# EasyEDA Pro project Balance_Car.eprj

# Schematic STM32平衡车原理图_1
Create Date: 2024-09-20; Page Name: P1; Project Name: ProDocument_P1_2024-05-12; Schematic Name: STM32平衡车原理图_1; Update Date: 2024-11-16; Company: 嘉立创EDA; Page Size: A4; Version: V1.0
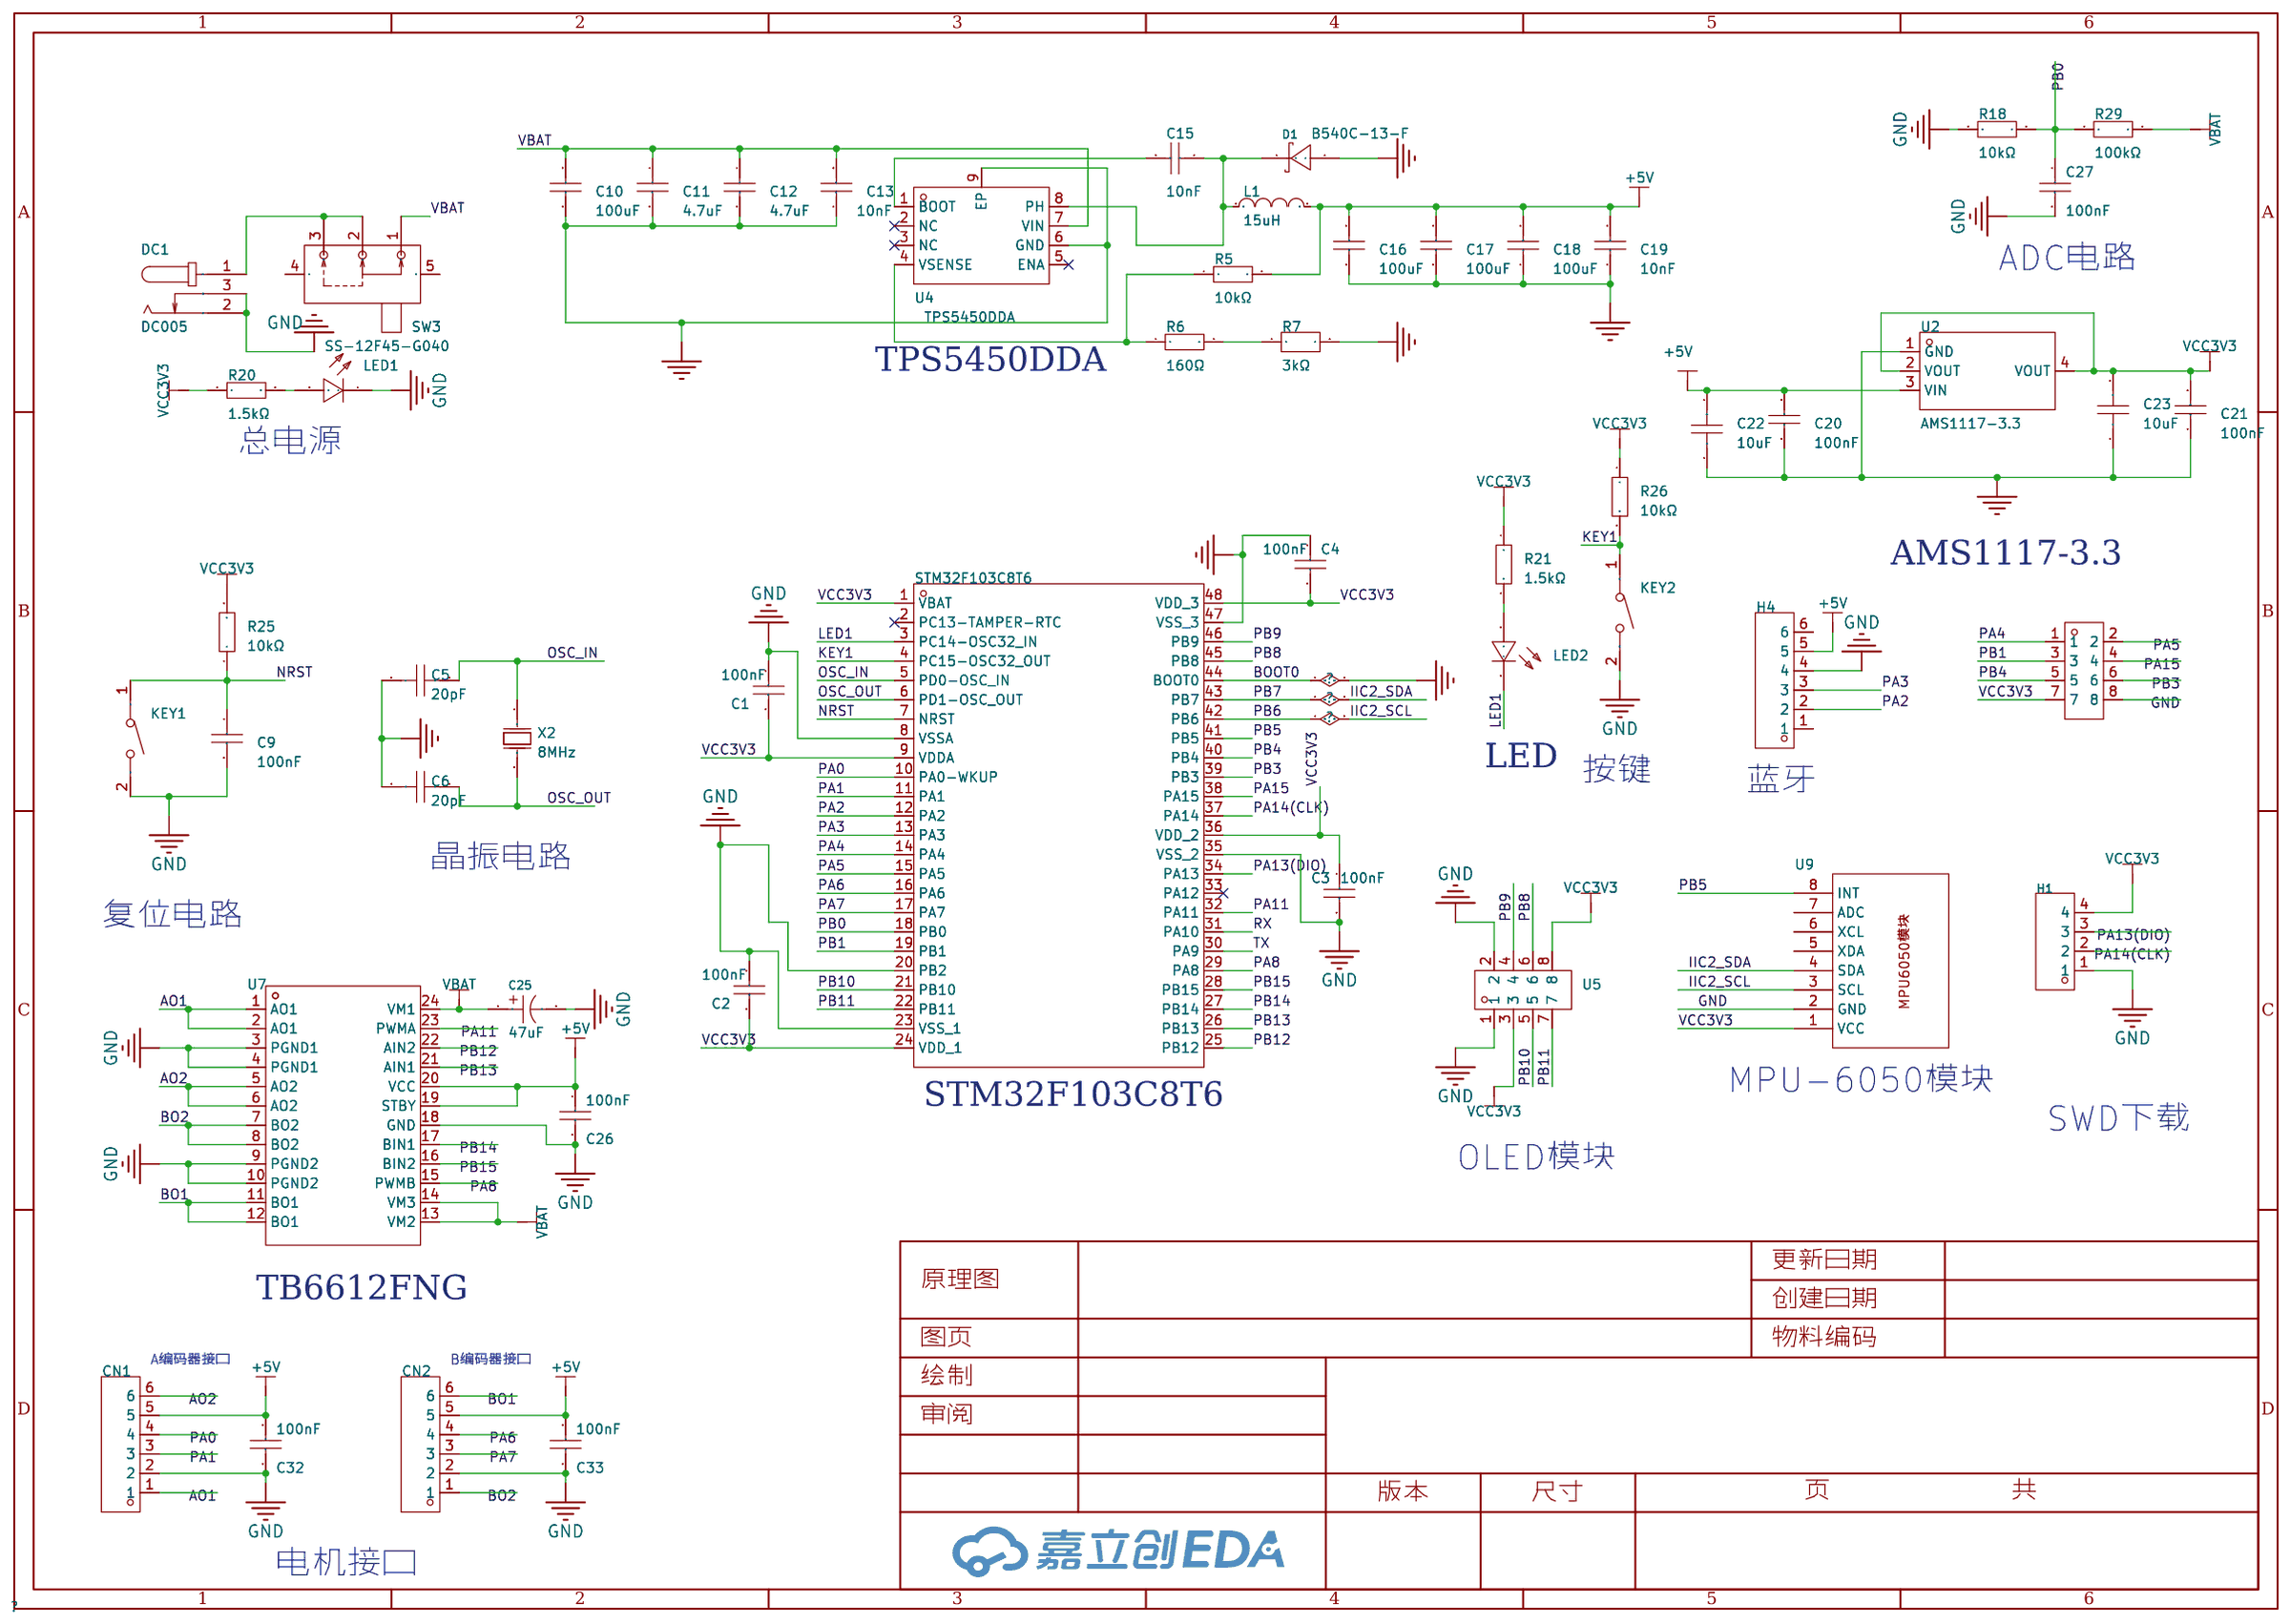
[diagram p0: schematic sheet]

## Parts
C1  100nF  [C0603]
C2  100nF  [C0603]
C3  100nF  [C0603]
C4  100nF  [C0603]
C5  20pF  [C0603]
C6  20pF  [C0603]
C9  100nF  [C0603]
C10  100uF  [C1206]
C11  4.7uF  [C0603]
C12  4.7uF  [C0603]
C13  10nF  [C0603]
C15  10nF  [C0603]
C16  100uF  [C1206]
C17  100uF  [C1206]
C18  100uF  [C1206]
C19  10nF  [C0603]
C20  100nF  [C0603]
C21  100nF  [C0603]
C22  10uF  [C0603]
C23  10uF  [C0603]
C25  47uF  [CAP-SMD_BD6.3-L6.6-W6.6-LS7.2-FD]
C26  100nF  [C0603]
C27  100nF  [C0603]
C32  100nF  [C0603]
C33  100nF  [C0603]
CN1  HC-XH-6AW-G  [CONN-TH_6P-P2.50_HC-XH-6AW-G]
CN2  HC-XH-6AW-G  [CONN-TH_6P-P2.50_HC-XH-6AW-G]
D1  B540C-13-F  [SMC_L7.1-W6.2-LS8.1-RD]
DC1  DC005  [DC-IN-TH_DC005]
H1  PZ254V-11-04P  [HDR-TH_4P-P2.54-V-M]
H3  X6521FV-2x04-C85D32  [HDR-TH_8P-P2.54-V-F-R2-C4-S2.54]
H4  A254UP-ZD06P  [HDR-TH_6P-P2.54-V-M]
KEY1  TS-1088-AR02016  [SW-TH_4P-L6.0-W6.0-P4.50-LS6.5]
KEY2  TS-1088-AR02016  [SW-TH_4P-L6.0-W6.0-P4.50-LS6.5]
L1  15uH  [IND-SMD_L7.0-W6.6_FXL0630]
LED1  NCD0603G1  [LED0603-RD]
LED2  NCD0603G1  [LED0603-RD]
R5  10kΩ  [R0603]
R6  160Ω  [R0603]
R7  3kΩ  [R0603]
R18  10kΩ  [R0603]
R20  1.5kΩ  [R0603]
R21  1.5kΩ  [R0603]
R25  10kΩ  [R0603]
R26  10kΩ  [R0603]
R29  100kΩ  [R0603]
SW3  SS-12F45-G040  [SW-TH_SS-12F45-GXXX]
U1  STM32F103C8T6  [LQFP-48_L7.0-W7.0-P0.50-LS9.0-BL]
U2  AMS1117-3.3  [SOT-223-3_L6.5-W3.4-P2.30-LS7.0-BR]
U4  TPS5450DDA  [SOP-8_L4.9-W3.9-P1.27-LS6.0-TL-EP-1]
U5  2541FV-2x4P  [HDR-TH_8P-P2.54-V-F-R2-C4-S2.54]
U7  TB6612FNG,C,8,EL  [SSOP-24_L8.3-W5.6-P0.65-LS7.6-BL]
U9  -  [mpu-6050模块]
X2  8MHz  [OSC-TH_L10.0-W4.5-P5.00]

## Library data of the parts
C1-C4 C9 C26 C27 C32 C33 = 0603B104K500NT: 容值:100nF;精度:±10%;额定电压:50V;材质(温度系数):X7R;; LCSC Part Name: 100nF ±10% 50V; Supplier Part: C30926; Manufacturer: FH(风华); Supplier Footprint: 0603; JLCPCB Part Class: 扩展库; Datasheet: https://atta.szlcsc.com/upload/public/pdf/source/20170923/C30926_1506149436298988724.pdf; Supplier: LCSC; Tolerance: ±10%; Voltage Rated: 50V; Temperature Coefficient: X7R
C5 C6 = 0805CG200J500NT: 容值:20pF;精度:±5%;额定电压:50V;材质(温度系数):C0G;; LCSC Part Name: 20pF ±5% 50V; Supplier Part: C94472; Manufacturer: FH(风华); Supplier Footprint: 0805; JLCPCB Part Class: 扩展库; Datasheet: https://atta.szlcsc.com/upload/public/pdf/source/20170923/C94472_1506149578159988997.pdf; Supplier: LCSC; Tolerance: ±5%; Voltage Rated: 50V; Temperature Coefficient: C0G
C10 C16-C18 = CL31A107MQHNNNE: 容值:100uF;精度:±20%;额定电压:6.3V;材质(温度系数):X5R;; LCSC Part Name: 100uF ±20% 6.3V; Supplier Part: C15008; Manufacturer: SAMSUNG(三星); Supplier Footprint: 1206; JLCPCB Part Class: 基础库; Datasheet: https://atta.szlcsc.com/upload/public/pdf/source/20160218/1457707763339.pdf; Supplier: LCSC; Tolerance: ±20%; Voltage Rated: 6.3V; Temperature Coefficient: X5R
C11 C12 = CL10A475KA8NQNC: 容值:4.7uF;精度:±10%;额定电压:25V;材质(温度系数):X5R;; LCSC Part Name: 4.7uF ±10% 25V; Supplier Part: C69335; Manufacturer: SAMSUNG(三星); Supplier Footprint: 0603; JLCPCB Part Class: 扩展库; Datasheet: https://atta.szlcsc.com/upload/public/pdf/source/20161108/1478586410580.pdf; Supplier: LCSC; Tolerance: ±10%; Voltage Rated: 25V; Temperature Coefficient: X5R
C13 C15 C19 = CC0603KRX7R9BB103: 容值:10nF;精度:±10%;额定电压:50V;材质(温度系数):X7R;; LCSC Part Name: 10nF ±10% 50V; Supplier Part: C100042; Manufacturer: YAGEO(国巨); Supplier Footprint: 0603; JLCPCB Part Class: 扩展库; Datasheet: https://atta.szlcsc.com/upload/public/pdf/source/20181008/C309510_22F155564471FAF6A489F7D68F34234E.pdf; Supplier: LCSC; Tolerance: ±10%; Voltage Rated: 50V; Temperature Coefficient: X7R
C20 C21 = 0603B104K500NT: 容值:100nF;精度:±10%;额定电压:50V;材质(温度系数):X7R;; LCSC Part Name: 100nF ±10% 50V; Supplier Part: C30926; Manufacturer: FH(风华); Supplier Footprint: 0603; JLCPCB Part Class: 扩展库; Datasheet: https://atta.szlcsc.com/upload/public/pdf/source/20200305/C486355_26A10D38EF8C2A5C37091D0039909270.pdf; Supplier: LCSC; Tolerance: ±10%; Voltage Rated: 50V; Temperature Coefficient: X7R
C22 C23 = GRM21BR61H106KE43L: 容值:10uF;精度:±10%;额定电压:50V;材质(温度系数):X5R;; LCSC Part Name: 10uF ±10% 50V; Supplier Part: C440198; Manufacturer: muRata(村田); Supplier Footprint: 0805; JLCPCB Part Class: 基础库; Datasheet: https://atta.szlcsc.com/upload/public/pdf/source/20230811/95AAE0C9AF55EDC31B7A4D8B733F534E.pdf; Supplier: LCSC; Tolerance: ±10%; Voltage Rated: 50V; Temperature Coefficient: X5R
C25 = RVT47UF35V67RV0039: 容值:47uF;额定电压:35V;电容体直径:-;电容体长度:-;纹波电流:-;等效串联电阻:-;工作寿命:2000hrs@105℃;; LCSC Part Name: 47uF 35V; Supplier Part: C2836440; Manufacturer: KNSCHA(科尼盛); Supplier Footprint: SMD,6.3x5.4mm; JLCPCB Part Class: 扩展库; Supplier: LCSC; Rated Voltage: 35V; Lifetime @ Temp: 2000hrs@105℃
CN1 CN2 = HC-XH-6AW-G: 插针结构:1x6P;间距:2.54mm;公母:公;安装方式:弯插;行距:2.54mm;排数:1;每排PIN数:6;参考系列:XH;额定电流:3A;工作温度范围:-25℃~+85℃;; LCSC Part Name: 1x6P 间距:2.54mm 弯插 系列:XH; Supplier Part: C5341212; Manufacturer: HCTL(华灿天禄); Supplier Footprint: 弯插,P=2.5mm; JLCPCB Part Class: 扩展库; Datasheet: https://atta.szlcsc.com/upload/public/pdf/source/20230711/B565BAF3B11666EF6B81B3605408F2BD.pdf; Supplier: LCSC; Pins Structure: 1x6P; Pitch: 2.54mm; Gender: 公; Mounting Style: 弯插; Row Spacing: 2.54mm; Number of Rows: 1; Number of PINs Per Row: 6; Reference Series: XH; Current Rating (Max): 3A; Operating Temperature Range: -25℃~+85℃
D1 = B540C-13-F: 直流反向耐压(Vr):40V;平均整流电流(Io):5A;正向压降(Vf):550mV@5A;; LCSC Part Name: 电压:40V 电流:5A; Supplier Part: C72264; Manufacturer: DIODES(美台); Supplier Footprint: SMC(DO-214AB); JLCPCB Part Class: 扩展库; Datasheet: https://atta.szlcsc.com/upload/public/pdf/source/20171023/C134461_15087453602301052556.pdf; Supplier: LCSC; Reverse Voltage (Vr): 40V; Average Rectified Current (Io): 5A; Forward Voltage (Vf@If): 550mV@5A; Reverse Leakage Current (Ir): 500uA@40V
DC1 = DC005: 连接器类型:DC电源插座;安装方式:弯插;触点内径:2mm;触点外径:6.3mm;额定电流:500mA;额定电压:30V;工作温度范围:-40℃~+55℃;; LCSC Part Name: DC电源插座 内径:2mm 外径:6.3mm; Supplier Part: C431533; Manufacturer: SHOU HAN(首韩); Supplier Footprint: 插件; JLCPCB Part Class: 扩展库; Datasheet: https://atta.szlcsc.com/upload/public/pdf/source/20190925/C431533_4751811035784AC1D38EBC85F7905E99.pdf; Supplier: LCSC; Connector Type: DC电源插座; Mounting Style: 弯插; Inside Contact Diameter: 2mm; Outside Contact Diameter: 6.3mm; Current Rating (Max): 500mA; Voltage Rating (Max): 30V; Operating Temperature Range: -40℃~+55℃
H1 = PZ254V-11-04P: 排数:单排;总PIN位数:4P;间距:2.54mm;插针结构:1x4P;行距:-;安装类型:直插;圆针/方针:方针;额定电流:3A;额定电压:250V;配合针长度:6mm;塑高:2.5mm;端接针长度:3mm;触头材质:-;工作温度范围:-40℃~+105℃;颜色:黑色;; LCSC Part Name: 2.54mm 1x4P 直插 方针; Supplier Part: C2691448; Manufacturer: XFCN(兴飞); Supplier Footprint: 插件,P=2.54mm; JLCPCB Part Class: 扩展库; Datasheet: https://atta.szlcsc.com/upload/public/pdf/source/20200309/C492403_F9F19131791D08044AD4F84F8E751A34.pdf; Supplier: LCSC; Number of Rows: 单排; Number of Pins: 4P; Pitch: 2.54mm; Pin Structure: 1x4P; Mounting Type: 直插; Circluar Pins/Square Pins: 方针; Current Rating (Max): 3A; Voltage Rating (Max): 250V; Length of Mating Pin: 6mm; Insulation Height: 2.5mm; Length of End Connection Pin: 3mm; Operating Temperature Range: -40℃~+105℃; Color: 黑色
H3 = X6521FV-2x04-C85D32: 排数:双排;总孔位数:8;间距:2.54mm;插孔结构:2x4P;行距:2.54mm;安装类型:直插;圆孔/方孔:方孔;额定电流:3A;额定电压:250V;插孔方向:顶部;塑高:8.5mm;触头材质:黄铜;触头镀层:金;工作温度范围:-40℃~+105℃;焊接温度(最大值):260℃;; LCSC Part Name: 2.54mm 2x4P; Supplier Part: C718232; Manufacturer: XKB Connectivity(中国星坤); Supplier Footprint: 插件,P=2.54mm; JLCPCB Part Class: 扩展库; Supplier: LCSC; Number of Rows: 双排; Number of Holes: 8; Pitch: 2.54mm; Holes Structure: 2x4P; Row Spacing: 2.54mm; Mounting Type: 直插; Circular Hole / Square Hole: 方孔; Current Rating (Max): 3A; Voltage Rating (Max): 250V; Holes Direction: 顶部; Insulation Height: 8.5mm; Contact Material: 黄铜; Contact Plating: 金; Operating Temperature Range: -40℃~+105℃; Welding Temperature (Max): 260℃
H4 = A254UP-ZD06P: 插针结构:1x6P;间距:2.54mm;行距:-;圆针/方针:方针;安装类型:直插;排数:单排;总PIN位数:6P;额定电流:3A;配合针长度:6mm;塑高:2.5mm;工作温度范围:-40℃~+105℃;; LCSC Part Name: 排针 间距:2.54mm 1x6P 直插 方针; Supplier Part: C41413835; Manufacturer: BXCONN(宝讯); Supplier Footprint: 插件,P=2.54mm; Datasheet: https://atta.szlcsc.com/upload/public/pdf/source/20240923/97072FDD30E0172C4307BFCEFD04900D.pdf; Supplier: LCSC; Pin Structure: 1x6P; Pitch: 2.54mm; Circluar Pins/Square Pins: 方针; Mounting Type: 直插; Number of Rows: 单排; Number of Pins: 6P; Current Rating (Max): 3A; Length of Mating Pin: 6mm; Insulation Height: 2.5mm; Operating Temperature Range: -40℃~+105℃
KEY1 KEY2 = TS-1088-AR02016: 触点电流:50mA;额定电压(DC):12V;绝缘电阻:100MΩ;电路结构:单刀单掷;安装方式:立贴;作用力:160gf@±50gf;机械寿命:10万次;带支架:否;; LCSC Part Name: 4*3*2mm 立贴 轻触开关; Supplier Part: C720477; Manufacturer: XUNPU(讯普); Supplier Footprint: SMD; JLCPCB Part Class: 扩展库; Datasheet: https://atta.szlcsc.com/upload/public/pdf/source/20200810/C720475_60D09DD6C54279ADDB2DC25100F1CC11.pdf; Supplier: LCSC; Contact Current: 50mA; Voltage Rating (DC): 12V; Insulation Resistance: 100MΩ; Circuit: 单刀单掷; Mounting Style: 立贴; Actuator Style: 圆形按钮; Actuator/Cap Color: 黑色; Operating Force: 160gf@±50gf; Mechanical Life: 10万次; Operating Temperature: -30℃~+80℃; Pin Style: SMD接片; Switch Length: 4mm; Switch Width: 3mm; Switch Height: 2mm; Strike Gundam: 否
L1 = FXL0630-150-M: 电感值:15uH;精度:±20%;额定电流:3A;类型:一体成型电感;饱和电流(Isat):4.5A;; LCSC Part Name: 15uH ±20% 4.5A; Supplier Part: C177243; Manufacturer: cjiang(长江微电); Supplier Footprint: SMD,6.6x7mm; JLCPCB Part Class: 扩展库; Datasheet: https://atta.szlcsc.com/upload/public/pdf/source/20230516/3A080F5AF8C87BB81C3BA86E5F60E51A.pdf; Supplier: LCSC; Tolerance: ±20%; Rated Current: 3A; Type: 一体成型电感; DC Resistance (DCR): 115mΩ; Saturation Current (Isat): 4.5A
LED1 LED2 = NCD0603G1: 发光颜色:翠绿色;正向电压(VF):2.6V~3.6V;功率:72mW;正向电流:10mA;主波长:515nm~530nm;透镜颜色:无色透明;发光强度:330mcd~900mcd;发光角度:130°;工作温度:-30℃~+85℃;; Supplier Part: C84267; Manufacturer: 国星光电; Supplier Footprint: 0603; JLCPCB Part Class: 扩展库; Datasheet: https://atta.szlcsc.com/upload/public/pdf/source/20200820/C84267_04BA7703640BAC111D09F5EFB971FBF3.pdf; Supplier: LCSC; Emitted Color: 翠绿色; Forward Voltage (VF): 2.6V~3.6V; Power Dissipation: 72mW; Forward Current: 10mA; Dominant Wavelength: 515nm~530nm; Lens Color: 无色透明; Luminous Intensity: 330mcd~900mcd; Viewing Angle: 130°; Operating Temperature: -30℃~+85℃
R5 R18 R25 R26 = 0603WAF1002T5E: 阻值:10kΩ;精度:±1%;功率:100mW;温度系数:±100ppm/℃;电阻类型:厚膜电阻;; LCSC Part Name: 10kΩ ±1% 100mW 厚膜电阻; Supplier Part: C25804; Manufacturer: UNI-ROYAL(厚声); Supplier Footprint: 0603; JLCPCB Part Class: 基础库; Datasheet: https://atta.szlcsc.com/upload/public/pdf/source/20200306/C422600_1E6D84923E4A46A82E41ADD87F860B5C.pdf; Supplier: LCSC; Tolerance: ±1%; Power(Watts): 100mW; Overload Voltage (Max): 75V; Temperature Coefficient: ±100ppm/℃; Type: 厚膜电阻; Operating Temperature Range: -55℃~+155℃
R6 = 0603WAF0000T5E: 阻值:0Ω;精度:±1%;功率:100mW;电阻类型:厚膜电阻;; LCSC Part Name: 0Ω ±1% 100mW 厚膜电阻; Supplier Part: C21189; Manufacturer: UNI-ROYAL(厚声); Supplier Footprint: 0603; JLCPCB Part Class: 基础库; Datasheet: https://atta.szlcsc.com/upload/public/pdf/source/20200306/C422600_1E6D84923E4A46A82E41ADD87F860B5C.pdf; Supplier: LCSC; Tolerance: ±1%; Power(Watts): 100mW; Overload Voltage (Max): 75V; Type: 厚膜电阻; Operating Temperature Range: -55℃~+155℃
R7 = FRC0603F3161TS: 阻值:3.16kΩ;精度:±1%;功率:100mW;温度系数:±100ppm/℃;电阻类型:厚膜电阻;; LCSC Part Name: 3.16kΩ ±1% 100mW 厚膜电阻; Supplier Part: C2930087; Manufacturer: FOJAN(富捷); Supplier Footprint: 0603; JLCPCB Part Class: 扩展库; Datasheet: https://atta.szlcsc.com/upload/public/pdf/source/20211221/925EC7D7225764EE0046F22065062C87.pdf; Supplier: LCSC; Tolerance: ±1%; Power(Watts): 100mW; Overload Voltage (Max): 75V; Temperature Coefficient: ±100ppm/℃; Type: 厚膜电阻; Operating Temperature Range: -55℃~+155℃
R20 R21 = 0603WAF1501T5E: 阻值:1.5kΩ;精度:±1%;功率:100mW;温度系数:±100ppm/℃;电阻类型:厚膜电阻;; LCSC Part Name: 1.5kΩ ±1% 100mW 厚膜电阻; Supplier Part: C22843; Manufacturer: UNI-ROYAL(厚声); Supplier Footprint: 0603; JLCPCB Part Class: 基础库; Datasheet: https://atta.szlcsc.com/upload/public/pdf/source/20200306/C422600_1E6D84923E4A46A82E41ADD87F860B5C.pdf; Supplier: LCSC; Tolerance: ±1%; Power(Watts): 100mW; Overload Voltage (Max): 75V; Temperature Coefficient: ±100ppm/℃; Type: 厚膜电阻; Operating Temperature Range: -55℃~+155℃
R29 = RC0603FR-07100KL: 电阻类型:厚膜电阻;阻值:100kΩ;精度:±1%;功率:100mW;温度系数:±100ppm/℃;; LCSC Part Name: 厚膜电阻 100kΩ ±1% 100mW; Supplier Part: C14675; Manufacturer: YAGEO(国巨); Supplier Footprint: 0603; JLCPCB Part Class: 扩展库; Datasheet: https://atta.szlcsc.com/upload/public/pdf/source/20140324/1457707028752.pdf; Supplier: LCSC; Type: 厚膜电阻; Tolerance: ±1%; Power(Watts): 100mW; Temperature Coefficient: ±100ppm/℃; Overload Voltage (Max): 75V; Operating Temperature Range: -55℃~+155℃
SW3 = SS-12F45-G040: 电路结构:单刀双掷;安装方式:直插;开关颜色:黑色;额定电流(DC):1A;额定电压(DC):24V;机械寿命:1万次;; LCSC Part Name: 柄长4mm 直插两档 滑动开关; Supplier Part: C2876011; Manufacturer: G-Switch(品赞); Supplier Footprint: 插件; JLCPCB Part Class: 扩展库; Datasheet: https://atta.szlcsc.com/upload/public/pdf/source/20210810/54507F6EFD03BF44F041BE2B3940D381.pdf; Supplier: LCSC; Circuit: 单刀双掷; Actuator Style: 矩形柱状; Pin Style: PC引脚; Switch Length: 12mm; Switch Width: 5.6mm; Switch Height: 9.5mm; Mounting Style: 直插; Actuator Color: 黑色; Current Rating (DC): 1A; Voltage Rating (DC): 24V; Mechanical Life: 1万次; Operating Temperature: -25℃~+70℃
U1 = STM32F103C8T6: CPU内核:ARM Cortex-M3;CPU最大主频:72MHz;程序存储容量:64KB;程序存储器类型:FLASH;RAM总容量:20KB;GPIO端口数量:37;ADC(位数):12bit;工作温度范围:-40℃~+85℃;; LCSC Part Name: ARM Cortex-M3 72MHz MSL=3; Supplier Part: C8734; Manufacturer: ST(意法半导体); Supplier Footprint: LQFP-48(7x7); JLCPCB Part Class: 基础库; Datasheet: https://atta.szlcsc.com/upload/public/pdf/source/20220812/8363ACEC51AD55ECEB84799464F7CB85.pdf; Supplier: LCSC; CPU Core: ARM Cortex-M3; CPU Maximum Speed: 72MHz; Operating Voltage Range: 2V~3.6V; Program Storage Size: 64KB; Program Memory Type: FLASH; RAM Size: 20KB; EEPROM: 64KB; GPIO Ports Number: 37; ADC (Bit): 12bit; Peripheral/Function: 看门狗；DMA；看门狗；片载温度传感器; Internal Oscillator: 有; Operating Temperature Range: -40℃~+85℃
U2 = AMS1117-3.3_C6186: 输出类型:固定;最大输入电压:-;输出电压:3.3V;输出电流:1A;电源纹波抑制比(PSRR):72dB@(120Hz);输出极性:正;; LCSC Part Name: 输出3.3V 1A; Supplier Part: C6186; Manufacturer: AMS; Supplier Footprint: SOT-223-3; JLCPCB Part Class: 基础库; Datasheet: https://atta.szlcsc.com/upload/public/pdf/source/20180727/C6186_7A095716F0823C02F1997A905E26C086.pdf; Supplier: LCSC; Output Type: 固定; Output Voltage: 3.3V; Output Current: 1A; Power Supply Rejection Ratio (PSRR): 72dB@(120Hz); Dropout Voltage: 1.3V@(800mA); Output Polarity: 正; Number of Outputs: 1
U4 = TPS5450DDA: 功能类型:降压型;同步整流:否;输出类型:可调;输出通道数:1;拓扑结构:降压式;输入电压:5.5V~36V;输出电压:1.221V~31.32V;输出电流(最大值):5A;开关频率:500kHz;工作温度:-40℃~+125℃@(TJ);; LCSC Part Name: 降压型 Vin=5.5V~36V Vout=1.221V~31.32V 5A; Supplier Part: C1355315; Manufacturer: TI(德州仪器); Supplier Footprint: Power-Pad-SO-8; JLCPCB Part Class: 扩展库; Supplier: LCSC; Function: 降压型; Synchronous Rectification: 否; Output Type: 可调; Number of Outputs: 1; Topology: 降压式; Input Voltage: 5.5V~36V; Output Voltage: 1.221V~31.32V; Output Current (Max): 5A; Switching Frequency: 500kHz; Operating Temperature: -40℃~+125℃@(TJ)
U5 = 2541FV-2x4P: 插孔结构:2x4P;间距:2.54mm;总孔位数:8P;安装类型:直插;排数:双排;圆孔/方孔:方孔;额定电流:3A;额定电压:250V;插孔方向:顶部;工作温度范围:-40℃~+105℃;; LCSC Part Name: 间距:2.54mm 2x4P 直插; Supplier Part: C18723055; Manufacturer: HanElectricity(瀚源); Supplier Footprint: 插件,P=2.54mm; Datasheet: https://atta.szlcsc.com/upload/public/pdf/source/20231018/348A30CBB18FAA04E40F2CE12A6EAA75.pdf; Supplier: LCSC; Holes Structure: 2x4P; Pitch: 2.54mm; Number of Holes: 8P; Mounting Type: 直插; Number of Rows: 双排; Circular Hole / Square Hole: 方孔; Current Rating (Max): 3A; Voltage Rating (Max): 250V; Holes Direction: 顶部; Operating Temperature Range: -40℃~+105℃
U7 = TB6612FNG,C,8,EL: 类型:有刷直流电机;电源电压:2.7V~5.5V;输出电流:1A;接口:并行;; Supplier Part: C141517; Manufacturer: TOSHIBA(东芝); Supplier Footprint: SSOP-24; JLCPCB Part Class: 扩展库; Datasheet: https://atta.szlcsc.com/upload/public/pdf/source/20171128/C141517_15118625624231147036.pdf; Supplier: LCSC; Type: 有刷直流电机; Supply Voltage: 2.7V~5.5V; Output Current: 1A; Interface: 并行; Operating Temperature: -20℃~+85℃@(Ta)
U9 = MPU-6050模块
X2 = X49SD8MSD2SC: 晶振类型:直插晶振;频率:8MHz;常温频差:±20ppm;外接负载电容:20pF;频率稳定度(全温):±30ppm;; LCSC Part Name: 8MHz ±20ppm 20pF; Supplier Part: C21263; Manufacturer: YXC(扬兴晶振); Supplier Footprint: HC-49S; JLCPCB Part Class: 扩展库; Datasheet: https://atta.szlcsc.com/upload/public/pdf/source/20240329/977D7F2434F98B2BE33270BB9FF3D86D.pdf; Supplier: LCSC; Crystal Type: 直插晶振; Normal temperature Frequency Tolerance: ±20ppm; External load capacitor: 20pF; Frequency Stability(Full temperature range): ±30ppm; Operating Temperature: -20℃~+70℃

## Nets
+5V: C16.2 C17.2 C18.2 C19.2 C20.2 C22.2 C26.1 C32.1 C33.1 CN1.5 CN2.5 H4.5 L1.2 R5.2 U2.3(VIN) U7.19(STBY) U7.20(VCC)
GND: C1.1 C2.1 C3.2 C4.1 C5.2 C6.2 C9.2 C10.1 C11.2 C12.2 C13.1 C16.1 C17.1 C18.1 C19.1 C20.1 C21.1 C22.1 C23.1 C25.2 C26.2 C27.2 C32.2 C33.2 CN1.2 CN2.2 D1.2(A) DC1.2 DC1.3 H1.1 H3.8 H4.4 KEY1.2 KEY2.2 LED1.1(K) R7.2 R18.1 U1.8(VSSA) U1.20(PB2) U1.23(VSS_1) U1.35(VSS_2) U1.44(BOOT0) U1.47(VSS_3) U2.1(GND) U4.6(GND) U4.9(EP) U5.1 U5.2 U7.3(PGND1) U7.4(PGND1) U7.9(PGND2) U7.10(PGND2) U7.18(GND) U9.2(GND)
VBAT: C10.2 C11.1 C12.1 C13.2 C25.1 R29.2 SW3.1 U4.7(VIN) U7.13(VM2) U7.14(VM3) U7.24(VM1)
VCC3V3: C1.2 C2.2 C3.1 C4.2 C21.2 C23.2 H1.4 H3.7 R20.1 R21.1 R25.2 R26.1 U1.1(VBAT) U1.9(VDDA) U1.24(VDD_1) U1.36(VDD_2) U1.48(VDD_3) U2.2(VOUT) U2.4(VOUT) U5.3 U5.8 U9.1(VCC)
AO1: CN1.1 U7.1(AO1) U7.2(AO1)
AO2: CN1.6 U7.5(AO2) U7.6(AO2)
BO1: CN2.6 U7.11(BO1) U7.12(BO1)
BO2: CN2.1 U7.7(BO2) U7.8(BO2)
IIC2_SCL: U1.42(PB6) U9.3(SCL)
IIC2_SDA: U1.43(PB7) U9.4(SDA)
KEY1: KEY2.1 R26.2 U1.4(PC15-OSC32_OUT)
LED1: LED2.1(K) U1.3(PC14-OSC32_IN)
NRST: C9.1 KEY1.1 R25.1 U1.7(NRST)
OSC_IN: C5.1 U1.5(PD0-OSC_IN) X2.1(OSC1)
OSC_OUT: C6.1 U1.6(PD1-OSC_OUT) X2.2(OSC2)
PA0: CN1.4 U1.10(PA0-WKUP)
PA1: CN1.3 U1.11(PA1)
PA2: H4.2 U1.12(PA2)
PA3: H4.3 U1.13(PA3)
PA4: H3.1 U1.14(PA4)
PA5: H3.2 U1.15(PA5)
PA6: CN2.4 U1.16(PA6)
PA7: CN2.3 U1.17(PA7)
PA8: U1.29(PA8) U7.15(PWMB)
PA11: U1.32(PA11) U7.23(PWMA)
PA13(DIO): H1.3 U1.34(PA13)
PA14(CLK): H1.2 U1.37(PA14)
PA15: H3.4 U1.38(PA15)
PB0: C27.1 R18.2 R29.1 U1.18(PB0)
PB1: H3.3 U1.19(PB1)
PB3: H3.6 U1.39(PB3)
PB4: H3.5 U1.40(PB4)
PB5: U1.41(PB5) U9.8(INT)
PB8: U1.45(PB8) U5.6
PB9: U1.46(PB9) U5.4
PB10: U1.21(PB10) U5.5
PB11: U1.22(PB11) U5.7
PB12: U1.25(PB12) U7.22(AIN2)
PB13: U1.26(PB13) U7.21(AIN1)
PB14: U1.27(PB14) U7.17(BIN1)
PB15: U1.28(PB15) U7.16(BIN2)
RX: U1.31(PA10)
TX: U1.30(PA9)
$1N2900: R6.2 R7.1
$1N2902: R5.1 R6.1 U4.4(VSENSE)
$1N2904: C15.2 U4.1(BOOT)
$1N3295: C15.1 D1.1(K) L1.1 U4.8(PH)
$1N3619: LED2.2(A) R21.2
$1N3622: LED1.2(A) R20.2
$1N21548: DC1.1 SW3.2 SW3.3

Not connected (* = marked no-connect by the designer): H4 1 6; SW3 4 5; U1 2(PC13-TAMPER-RTC)* 33(PA12)*; U4 2(NC)* 3(NC)* 5(ENA)*; U9 5(XDA) 6(XCL) 7(ADC)

## Notes on the sheet
- ADC电路
- TPS5450DDA
- 总电源
- AMS1117-3.3
- LED
- 按键
- 蓝牙
- 晶振电路
- 复位电路
- MPU-6050模块
- STM32F103C8T6
- SWD下载
- OLED模块
- TB6612FNG
- A编码器接口
- B编码器接口
- 电机接口

# Board PCB1
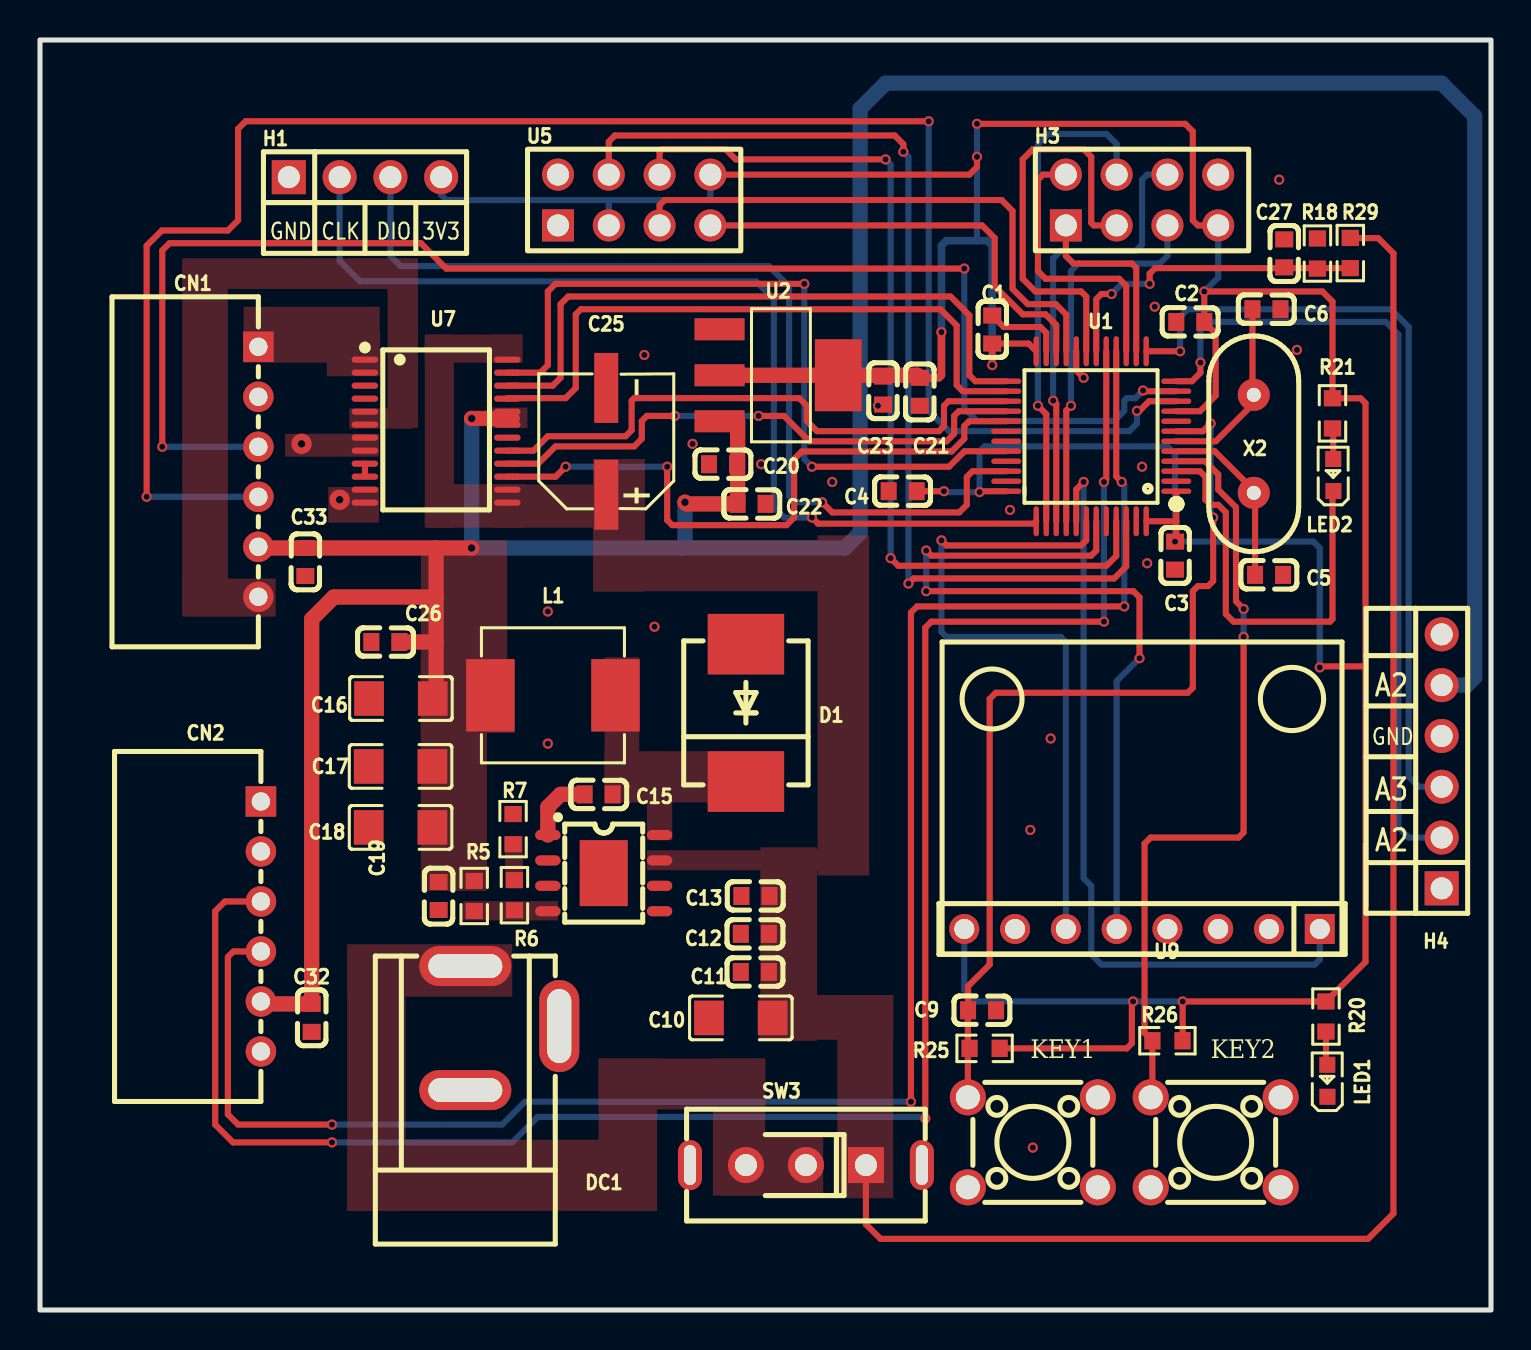
[diagram p1: board, top side]
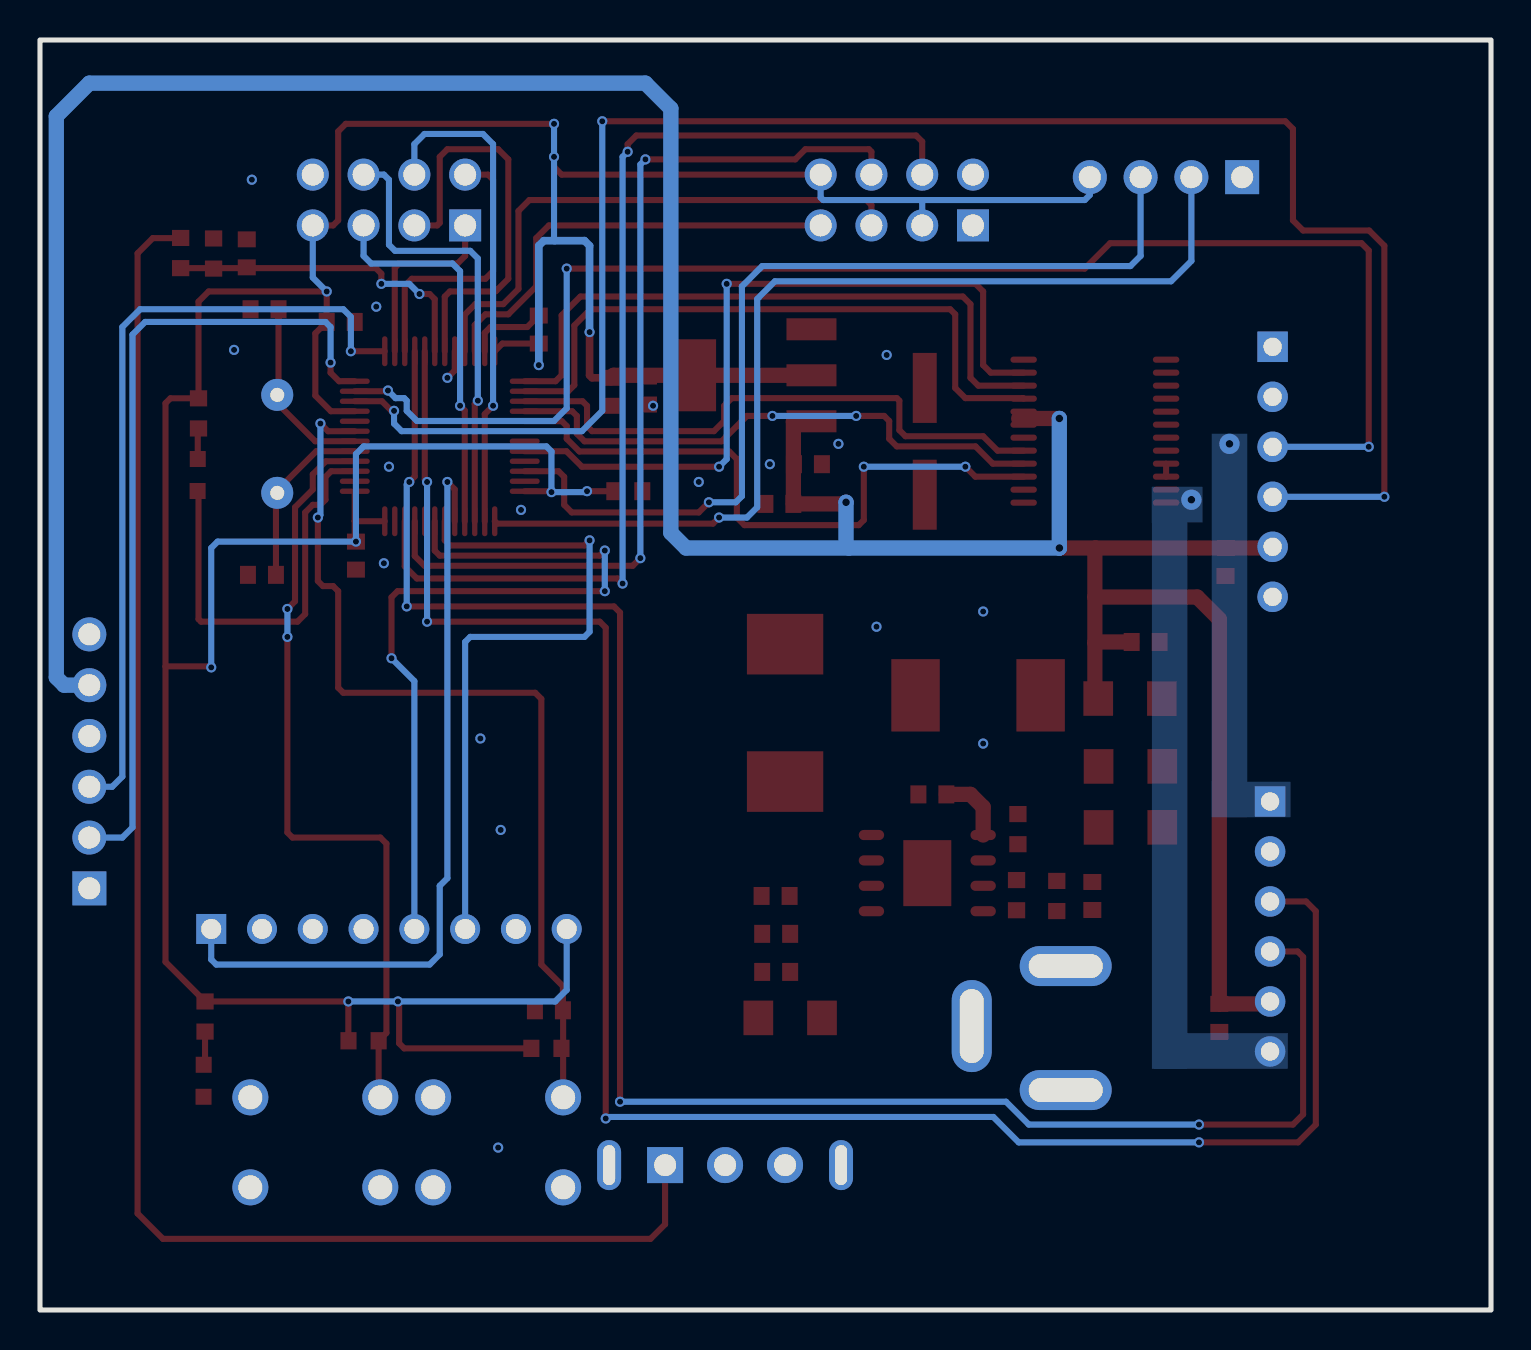
[diagram p2: board, bottom side, seen from below]

Outline 72.57 x 63.5 mm; copper layers: Top Layer, Bottom Layer. Coordinates in mm from the lower left corner of the outline.
Outline path: rectangle 0,63.5 72.57,0
Stack: Top Layer 0.035mm / Dielectric1 1.51mm FR4 er 4.5 / Bottom Layer 0.035mm

## Design rules (mm)
template: JLCPCB Capability(Two Layers Board)
spacing copperThickness1oz (default): track to track 0.102, other pairs 0.152 to 0.3
spacing copperThickness2oz: track to track 0.203, other pairs 0.152 to 0.3
track width copperThickness1oz (default): min 0.127, default 0.254, max 2.54
track width copperThickness2oz: min 0.203, default 0.254, max 2.54
differential pair differentialPair (default): width min 0.127, default 0.254, max 2.54; gap min 0.152, default 0.152
via viaSize (default): diameter min 0.5, default 0.61, max 10; hole min 0.3, default 0.305, max 6.3

## Placement (name value [footprint] x y rotation side)
C1  100nF  [C0603]  47.63 49.02 270 top
C2  100nF  [C0603]  57.53 49.4 0 top
C3  100nF  [C0603]  56.77 37.72 270 top
C4  100nF  [C0603]  43.15 40.94 0 top
C5  20pF  [C0603]  61.47 36.76 0 top
C6  20pF  [C0603]  61.34 50.04 0 top
C9  100nF  [C0603]  47.12 14.99 0 top
C10  100uF  [C1206]  35.05 14.61 0 top
C11  4.7uF  [C0603]  35.75 16.9 180 top
C12  4.7uF  [C0603]  35.75 18.81 180 top
C13  10nF  [C0603]  35.78 20.7 0 top
C15  10nF  [C0603]  27.94 25.78 180 top
C16  100uF  [C1206]  18.05 30.57 0 top
C17  100uF  [C1206]  18.03 27.18 0 top
C18  100uF  [C1206]  18.03 24.13 0 top
C19  10nF  [C0603]  19.94 20.7 90 top
C20  100nF  [C0603]  34.16 42.29 0 top
C21  100nF  [C0603]  44.01 45.91 90 top
C22  10uF  [C0603]  35.59 40.31 180 top
C23  10uF  [C0603]  42.16 45.97 90 top
C25  47uF  [CAP-SMD_BD6.3-L6.6-W6.6-LS7.2-FD]  28.32 43.43 90 top
C26  100nF  [C0603]  17.27 33.4 180 top
C27  100nF  [C0603]  62.23 52.83 90 top
C32  100nF  [C0603]  13.59 14.61 270 top
C33  100nF  [C0603]  13.27 37.4 270 top
CN1  HC-XH-6AW-G  [CONN-TH_6P-P2.50_HC-XH-6AW-G]  10.92 41.91 270 top
CN2  HC-XH-6AW-G  [CONN-TH_6P-P2.50_HC-XH-6AW-G]  11.05 19.18 270 top
D1  B540C-13-F  [SMC_L7.1-W6.2-LS8.1-RD]  35.31 29.86 90 top
DC1  DC005  [DC-IN-TH_DC005]  23.62 14.1 90 top
H1  PZ254V-11-04P  [HDR-TH_4P-P2.54-V-M]  16.26 56.64 0 top
H3  X6521FV-2x04-C85D32  [HDR-TH_8P-P2.54-V-F-R2-C4-S2.54]  55.12 55.5 0 top
H4  A254UP-ZD06P  [HDR-TH_6P-P2.54-V-M]  70.1 27.43 90 top
KEY1  TS-1088-AR02016  [SW-TH_4P-L6.0-W6.0-P4.50-LS6.5]  49.66 8.38 0 top
KEY2  TS-1088-AR02016  [SW-TH_4P-L6.0-W6.0-P4.50-LS6.5]  58.8 8.38 0 top
L1  15uH  [IND-SMD_L7.0-W6.6_FXL0630]  25.65 30.73 0 top
LED1  NCD0603G1  [LED0603-RD]  64.39 11.46 90 top
LED2  NCD0603G1  [LED0603-RD]  64.68 41.75 90 top
R5  10kΩ  [R0603]  21.72 20.7 90 top
R6  160Ω  [R0603]  23.73 20.74 90 top
R7  3kΩ  [R0603]  23.66 24.04 90 top
R18  10kΩ  [R0603]  63.89 52.82 270 top
R20  1.5kΩ  [R0603]  64.32 14.67 270 top
R21  1.5kΩ  [R0603]  64.64 44.83 270 top
R25  10kΩ  [R0603]  47.24 13.08 0 top
R26  10kΩ  [R0603]  56.39 13.46 180 top
R29  100kΩ  [R0603]  65.54 52.85 90 top
SW3  SS-12F45-G040  [SW-TH_SS-12F45-GXXX]  38.31 7.25 180 top
U1  STM32F103C8T6  [LQFP-48_L7.0-W7.0-P0.50-LS9.0-BL]  52.58 43.69 90 top
U2  AMS1117-3.3  [SOT-223-3_L6.5-W3.4-P2.30-LS7.0-BR]  36.96 46.74 180 top
U4  TPS5450DDA  [SOP-8_L4.9-W3.9-P1.27-LS6.0-TL-EP-1]  28.19 21.84 0 top
U5  2541FV-2x4P  [HDR-TH_8P-P2.54-V-F-R2-C4-S2.54]  29.72 55.5 0 top
U7  TB6612FNG,C,8,EL  [SSOP-24_L8.3-W5.6-P0.65-LS7.6-BL]  19.81 43.94 270 top
U9  -  [mpu-6050模块]  55.12 19.05 180 top
X2  8MHz  [OSC-TH_L10.0-W4.5-P5.00]  60.71 43.31 180 top

## Footprints (pads in the part's own frame, mm; a bottom-side part is the same pattern mirrored in y, then rotated)
C0603
  rect 0.8x0.9 smd: 1(-0.7,0) 2(0.7,0)
C1206
  rect 1.485x1.728 smd: 1(-1.593,0) 2(1.593,0)
CAP-SMD_BD6.3-L6.6-W6.6-LS7.2-FD
  rect 3.5x1.2 smd: 1(-2.67,0) 2(2.67,0)
CONN-TH_6P-P2.50_HC-XH-6AW-G
  rect 1.524x1.524 hole 0.914: 1(-6.25,0)
  round 1.524 hole 0.914: 2(-3.75,0) 3(-1.25,0) 4(1.25,0) 5(3.75,0) 6(6.25,0)
DC-IN-TH_DC005
  oval 2x4.6 hole 1.2x3.7: 1(3.1,2.35) 2(-3.1,2.35)
  oval 4.6x2 hole 3.7x1.2: 3(0.1,-2.35)
HDR-TH_4P-P2.54-V-M
  rect 1.7x1.7 hole 1.1: 1(-3.81,0)
  round 1.7 hole 1.1: 2(-1.27,0) 3(1.27,0) 4(3.81,0)
HDR-TH_6P-P2.54-V-M
  rect 1.7x1.7 hole 1.1: 1(-6.35,0)
  round 1.7 hole 1.1: 2(-3.81,0) 3(-1.27,0) 4(1.27,0) 5(3.81,0) 6(6.35,0)
HDR-TH_8P-P2.54-V-F-R2-C4-S2.54
  rect 1.6x1.6 hole 1.1: 1(-3.81,-1.27)
  round 1.6 hole 1.1: 2(-3.81,1.27) 3(-1.27,-1.27) 4(-1.27,1.27) 5(1.27,-1.27) 6(1.27,1.27) 7(3.81,-1.27) 8(3.81,1.27)
IND-SMD_L7.0-W6.6_FXL0630
  rect 2.424x3.62 smd: 1(3.128,0) 2(-3.128,0)
LED0603-RD
  rect 0.8x0.8 smd: 1(-0.799,-0.004) 2(0.799,0.004)
LQFP-48_L7.0-W7.0-P0.50-LS9.0-BL
  oval 0.27x1.5 smd: 1(-2.75,-4.25) 2(-2.25,-4.25) 3(-1.75,-4.25) 4(-1.25,-4.25) 5(-0.75,-4.25) 6(-0.25,-4.25) 7(0.25,-4.25) 8(0.75,-4.25) 9(1.25,-4.25) 10(1.75,-4.25) 11(2.25,-4.25) 12(2.75,-4.25) 25(2.75,4.25) 26(2.25,4.25) 27(1.75,4.25) 28(1.25,4.25) 29(0.75,4.25) 30(0.25,4.25) 31(-0.25,4.25) 32(-0.75,4.25) 33(-1.25,4.25) 34(-1.75,4.25) 35(-2.25,4.25) 36(-2.75,4.25)
  oval 1.5x0.27 smd: 13(4.25,-2.75) 14(4.25,-2.25) 15(4.25,-1.75) 16(4.25,-1.25) 17(4.25,-0.75) 18(4.25,-0.25) 19(4.25,0.25) 20(4.25,0.75) 21(4.25,1.25) 22(4.25,1.75) 23(4.25,2.25) 24(4.25,2.75) 37(-4.25,2.75) 38(-4.25,2.25) 39(-4.25,1.75) 40(-4.25,1.25) 41(-4.25,0.75) 42(-4.25,0.25) 43(-4.25,-0.25) 44(-4.25,-0.75) 45(-4.25,-1.25) 46(-4.25,-1.75) 47(-4.25,-2.25) 48(-4.25,-2.75)
mpu-6050模块
  round 1.5 hole 1: 1(8.89,0) 2(6.35,0) 3(3.81,0) 4(1.27,0) 5(-1.27,0) 6(-3.81,0) 7(-6.35,0)
  rect 1.5x1.5 hole 1: 8(-8.89,0)
OSC-TH_L10.0-W4.5-P5.00
  round 1.6 hole 0.7: 1(0,2.45) 2(0,-2.45)
R0603
  rect 0.806x0.864 smd: 1(-0.753,0) 2(0.753,0)
SMC_L7.1-W6.2-LS8.1-RD
  rect 3.03x3.82 smd: 1(-3.435,0) 2(3.435,0)
SOP-8_L4.9-W3.9-P1.27-LS6.0-TL-EP-1
  oval 1.27x0.508 smd: 1(-2.794,1.905) 2(-2.794,0.635) 3(-2.794,-0.635) 4(-2.794,-1.905) 5(2.794,-1.905) 6(2.794,-0.635) 7(2.794,0.635) 8(2.794,1.905)
  rect 2.4x3.3 smd: 9(0,0)
SOT-223-3_L6.5-W3.4-P2.30-LS7.0-BR
  rect 2.5x1.1 smd: 1(2.97,-2.3) 2(2.97,0) 3(2.97,2.3)
  rect 2.34x3.6 smd: 4(-2.97,0)
SSOP-24_L8.3-W5.6-P0.65-LS7.6-BL
  oval 0.308x1.324 smd: 1(-3.575,-3.562) 2(-2.925,-3.562) 3(-2.275,-3.562) 4(-1.625,-3.562) 5(-0.975,-3.562) 6(-0.325,-3.562) 7(0.325,-3.562) 8(0.975,-3.562) 9(1.625,-3.562) 10(2.275,-3.562) 11(2.925,-3.562) 12(3.575,-3.562) 13(3.575,3.562) 14(2.925,3.562) 15(2.275,3.562) 16(1.625,3.562) 17(0.975,3.562) 18(0.325,3.562) 19(-0.325,3.562) 20(-0.975,3.562) 21(-1.625,3.562) 22(-2.275,3.562) 23(-2.925,3.562) 24(-3.575,3.562)
SW-TH_4P-L6.0-W6.0-P4.50-LS6.5
  round 1.8 hole 1.2: 1(-3.25,2.25) 2(3.25,2.25) 3(-3.25,-2.25) 4(3.25,-2.25)
SW-TH_SS-12F45-GXXX
  rect 1.8x1.8 hole 1.1: 1(-3,0)
  round 1.8 hole 1.1: 2(0,0) 3(3,0)
  oval 1.2x2.5 hole 0.6x2: 4(5.8,0) 5(-5.8,0)

## Nets
As in the schematic, except:
GND: C1.1 C2.1 C3.2 C4.1 C5.2 C6.2 C9.2 C10.1 C11.2 C12.2 C13.1 C16.1 C17.1 C18.1 C19.1 C20.1 C21.1 C22.1 C23.1 C25.2 C26.2 C27.2 C32.2 C33.2 CN1.2 CN2.2 D1.2 DC1.2 DC1.3 H1.1 H3.8 H4.4 KEY1.3 KEY2.3 LED1.1 R7.2 R18.1 U1.8 U1.20 U1.23 U1.35 U1.44 U1.47 U2.1 U4.6 U4.9 U5.1 U5.2 U7.3 U7.4 U7.9 U7.10 U7.18 U9.2

Pads without a net: H4 1 6; KEY1 2 4; KEY2 2 4; SW3 4 5; U1 2 33; U4 2 3 5; U9 5 6 7

## Via types
v1: diameter 0.508, hole 0.305, Top Layer to Bottom Layer, 71 vias
v2: diameter 0.762, hole 0.381, Top Layer to Bottom Layer, 3 vias
v3: diameter 1.016, hole 0.381, Top Layer to Bottom Layer, 2 vias

## Routing (per net, layer and track width the routed paths; a pad name or vN(x,y) marks a point on that pad's centre or on a via; arc(x,y) is an arc through that point)
+5V: length 169.1
  Top Layer w0.762: 19.78,38.1 19.81,38.07 19.81,35.65 ; 19.78,38.1 v2(21.59,38.1) ; 19.78,38.1 C33.1 10.98,38.1 CN1.5 ; 19.81,35.65 14.69,35.65 13.59,34.54 C32.1 11.17,15.31 CN2.5 ; 19.81,35.65 19.81,33.36 ; 19.81,33.36 19.78,33.4 C26.1 ; 19.81,33.36 19.81,30.74 C16.2 ; v2(32.26,40.39) 32.34,40.31 C22.2 34.89,44.42 34.88,44.44 ; v2(21.59,44.58) 23.62,44.58
  Bottom Layer w0.762: v2(32.26,40.39) 32.26,38.24 32.12,38.1 ; 32.12,38.1 40.26,38.1 41.02,38.86 41.02,60.07 42.29,61.34 70.1,61.34 71.76,59.69 71.76,31.63 71.37,31.24 H4.5 ; 32.12,38.1 21.59,38.1 ; v2(21.59,38.1) 21.59,38.1 ; 21.59,38.1 v2(21.59,44.58)
GND: length 6.1
  Top Layer w0.305: U1.20 51.83,46.98 v1(52.2,46.61) ; C1.1 48.2,49.15 50.04,49.15 50.33,48.86 U1.23 ; U7.9 U7.10
  vias: v1(25.4,34.93) v1(25.4,28.32) v1(30.23,47.75) v1(30.73,34.16) v1(32.64,43.31) v1(36.07,42.29) v1(39.62,41.4) v1(41.91,45.21) v1(48.51,40.01) v1(49.53,24) v1(49.66,8.12) v1(50.55,28.58) v1(55.12,42.16) v1(55.37,37.34) v1(55.75,50.17) v1(61.98,56.52) v1(62.86,48.01)
VBAT: length 80.7
  Top Layer w0.305: SW3.1 41.31,4.28 42.04,3.56 66.42,3.56 67.69,4.83 67.69,52.83 66.93,53.59 65.54,53.59 R29.2
VCC3V3: length 211.5
  Top Layer w0.305: R25.2 54.36,13.08 54.61,13.34 54.61,15.37 v1(54.67,15.43) ; H3.7 57.91,54.23 57.66,54.48 57.66,58.93 57.28,59.31 v1(46.86,59.31) ; U1.9 58.02,44.94 58.8,45.72 58.8,48.83 C2.2 v1(58.23,50.93) 64.14,50.93 64.64,50.42 R21.1 66.05,45.58 66.29,45.34 66.29,32.18 ; U1.48 56.83,39.44 56.83,39.44 ; C4.2 v1(45.21,40.94) ; 66.29,32.18 66.29,17.4 R20.1 v1(57.15,15.43) 57.15,13.47 R26.1 ; 66.29,32.18 64.01,32.18 ; v1(46.86,57.66) 46.86,57.15 46.48,56.77 U5.8 ; v1(47.63,47.24) C1.2 49.44,48.32 U1.24 ; U1.1 56.83,40.94 56.83,39.44 ; 56.83,38.48 56.83,39.44 ; v1(46.99,40.89) 47.03,40.94 U1.36
  Top Layer w0.381: v1(45.08,48.9) 45.08,46.74 44.96,46.61 C21.2
  Top Layer w0.762: U2.2 U2.4 43.88,46.74 C21.2
  Bottom Layer w0.305: v1(54.67,15.43) 46.8,15.43 46.23,16 U9.1 ; v1(54.67,15.43) 54.61,15.37 ; v1(54.67,15.43) v1(57.15,15.43) ; v1(58.23,50.93) 58.93,51.62 H3.7 ; 28.42,55.5 33.4,55.5 33.53,55.63 U5.8 ; 28.42,55.5 20.32,55.5 20.07,55.75 H1.4 ; 28.42,55.5 28.45,55.47 U5.3 ; v1(46.86,59.31) v1(46.86,57.66) 46.86,53.51 46.82,53.47 ; v1(64.01,32.13) 64.01,38.1 63.69,38.42 v1(56.77,38.42) 56.77,42.8 56.39,43.18 47.24,43.18 46.99,42.93 v1(46.99,40.89) 45.26,40.89 v1(45.21,40.94)
  Bottom Layer w0.381: v1(47.63,47.24) 47.63,53.21 47.37,53.47 45.34,53.47 45.08,53.21 v1(45.08,48.9)
BO1:
  vias: v3(14.99,40.51)
BO2:
  vias: v3(13.08,43.31)
IIC2_SCL: length 33.8
  Top Layer w0.305: U1.42 52.33,38.49 52.07,38.23 45.34,38.23 v1(45.08,38.48)
  Bottom Layer w0.305: v1(45.08,38.48) 45.08,33.91 45.34,33.66 51.05,33.66 51.31,33.4 U9.3
IIC2_SDA: length 40.1
  Top Layer w0.305: v1(44.32,37.97) 44.58,37.72 52.58,37.72 52.83,37.97 U1.43 ; v1(44.32,35.94) 54.69,35.94 54.99,35.64 v1(54.99,32.59)
  Bottom Layer w0.305: v1(44.32,37.97) v1(44.32,35.94) ; v1(54.99,32.59) 53.85,31.45 U9.4
KEY1: length 38.9
  Top Layer w0.305: v1(60.2,35.05) 59.82,35.43 59.82,40.13 58.93,41.02 58.93,41.78 58.27,42.44 U1.4 ; KEY2.1 55.63,10.72 R26.2 55.25,13.85 55.25,23.32 55.55,23.62 59.94,23.62 60.2,23.88 v1(60.2,33.66)
  Bottom Layer w0.305: v1(60.2,33.66) v1(60.2,35.05)
LED1: length 21.1
  Top Layer w0.305: LED2.1 64.64,40.91 64.64,34.54 64.52,34.42 59.69,34.42 59.31,34.8 59.31,39.88 58.93,40.26 58.55,40.26 58.29,40.51 58.29,41.66 58.01,41.94 U1.3
NRST: length 46.6
  Top Layer w0.305: v1(58.67,39.62) 58.67,36.45 58.42,36.2 57.91,36.2 57.66,35.94 57.66,31.12 57.4,30.86 47.8,30.86 47.5,30.56 47.5,17.27 46.42,16.19 C9.1 46.41,14.98 KEY1.1 ; v1(58.55,44.32) 58.16,43.94 U1.7
  Bottom Layer w0.305: v1(58.67,39.62) 58.55,39.75 v1(58.55,44.32)
OSC_IN: length 8.8
  Top Layer w0.305: C5.1 60.77,40.79 60.71,40.86 ; U1.5 58.75,42.94 60.71,40.98
OSC_OUT: length 9.4
  Top Layer w0.305: C6.1 60.64,45.95 60.71,45.88 60.71,45.34 58.8,43.44 U1.6
PA0: length 90.8
  Top Layer w0.305: U1.10 55.47,45.44 54.99,44.96 v1(54.86,44.96) ; v1(44.45,59.44) 10.29,59.44 9.91,59.06 9.91,54.48 9.4,53.98 6.1,53.98 5.33,53.21 v1(5.33,40.66)
  Bottom Layer w0.305: v1(44.45,59.44) 44.45,44.96 45.47,43.94 54.48,43.94 54.86,44.32 v1(54.86,44.96) ; CN1.4 v1(5.33,40.66)
PA1: length 74.3
  Top Layer w0.305: v1(6.12,43.16) 6.12,52.98 6.48,53.34 19.05,53.34 20.32,52.07 v1(46.23,52.07) ; U1.11 55.2,45.94 v1(55.17,45.97)
  Bottom Layer w0.305: 55.25,45.97 v1(55.17,45.97) 54.79,45.59 54.36,45.59 54.23,45.47 54.23,44.96 53.72,44.45 46.86,44.45 46.23,45.09 v1(46.23,52.07) ; 6.1,43.18 v1(6.12,43.16) CN1.3
PA2: length 41
  Top Layer w0.305: v1(58.04,47.37) 58.04,46.86 57.61,46.44 U1.12
  Bottom Layer w0.305: H4.2 68.45,23.62 67.95,24.13 67.95,48.77 67.31,49.4 58.29,49.4 58.04,49.15 v1(58.04,47.37)
PA3: length 39.7
  Top Layer w0.305: U1.13 v1(57.02,47.94)
  Bottom Layer w0.305: v1(57.02,47.94) 57.02,49.66 57.4,50.04 67.56,50.04 68.45,49.15 68.45,26.67 68.96,26.16 H4.3
PA4: length 9.5
  Top Layer w0.305: U1.14 54.83,52.11 54.61,52.32 51.69,52.32 51.31,52.71 H3.1
PA5: length 14.1
  Top Layer w0.305: U1.15 54.33,51.21 53.98,51.56 50.29,51.56 49.91,51.94 49.91,56.52 50.17,56.77 H3.2
PA6: length 92.7
  Top Layer w0.305: v1(43.56,10.41) 43.56,34.87 43.87,35.18 v1(54.23,35.18) ; CN2.4 9.67,17.93 9.4,17.65 9.4,9.78 9.91,9.27 v1(14.61,9.27) ; v1(54.1,41.4) 53.83,41.68 U1.16
  Bottom Layer w0.305: v1(43.56,10.41) 24.26,10.41 23.11,9.27 v1(14.61,9.27) ; v1(54.1,41.4) 54.23,41.28 v1(54.23,35.18)
PA7: length 96.7
  Top Layer w0.305: v1(44.28,9.58) 44.28,34.12 44.58,34.42 v1(53.21,34.42) ; v1(53.21,41.4) 53.33,41.52 U1.17 ; CN2.3 9.25,20.43 8.76,19.94 8.76,9.27 9.65,8.38 v1(14.61,8.38)
  Bottom Layer w0.305: v1(53.21,34.42) v1(53.21,41.4) ; v1(14.61,8.38) 23.62,8.38 24.89,9.65 44.2,9.65
PA8: length 32.2
  Top Layer w0.305: U1.29 46.47,44.44 46.23,44.2 46.23,43.56 45.59,42.93 38.1,42.93 37.72,42.55 37.72,39.62 37.34,39.24 31.62,39.24 31.37,39.5 v1(31.37,42.16) ; U7.15 25.79,41.67 v1(26.29,42.16)
  Bottom Layer w0.305: v1(26.29,42.16) v1(31.37,42.16)
PA11: length 38.2
  Top Layer w0.305: U7.23 25.02,46.87 25.4,47.24 25.4,50.93 25.78,51.31 v1(38.23,51.31) ; v1(38.61,42.16) 45.47,42.16 46.24,42.94 U1.32
  Bottom Layer w0.305: v1(38.61,42.16) 38.23,42.55 v1(38.23,51.31)
PA13(DIO): length 47.9
  Top Layer w0.305: v1(39.12,40.39) 39.62,39.88 45.97,39.88 46.36,40.26 46.36,41.66 46.64,41.94 U1.34
  Bottom Layer w0.305: v1(39.12,40.39) 37.77,40.39 37.47,40.69 37.47,51.18 36.45,52.2 18.03,52.2 17.53,52.71 H1.3
PA14(CLK): length 50.6
  Top Layer w0.305: U1.37 49.71,39.32 38.91,39.32 v1(38.61,39.62)
  Bottom Layer w0.305: v1(38.61,39.62) 37.21,39.62 36.7,40.13 36.7,50.55 35.81,51.44 16,51.44 14.99,52.45 H1.2
PA15: length 24.9
  Top Layer w0.305: v1(49.91,45.21) 50.33,44.8 U1.38
  Bottom Layer w0.305: v1(49.91,45.21) 49.91,58.29 50.42,58.8 53.34,58.8 53.85,58.29 H3.4
PB0: length 16.3
  Top Layer w0.305: R29.1 55.78,52.09 55.5,51.82 v1(55.5,51.31) ; U1.18 52.83,50.54 53.09,50.8 v1(53.59,50.8)
  Bottom Layer w0.305: v1(55.5,51.31) 54.1,51.31 v1(53.59,50.8)
PB1: length 20.7
  Top Layer w0.305: U1.19 52.33,50.67 52.07,50.93 49.78,50.93 49.15,51.56 49.15,57.53 49.66,58.04 52.2,58.04 52.58,57.66 52.58,54.36 52.7,54.23 H3.3
PB3: length 22.6
  Top Layer w0.305: U1.39 50.83,45.31 v1(50.67,45.47)
  Bottom Layer w0.305: v1(50.67,45.47) 50.67,52.58 51.05,52.96 54.81,52.96 55.12,53.26 55.12,56.52 55.37,56.77 H3.6
PB4: length 19.3
  Top Layer w0.305: v1(51.56,45.21) 51.33,44.98 U1.40
  Bottom Layer w0.305: v1(51.56,45.21) 51.56,51.94 51.94,52.32 56.01,52.32 56.39,52.71 H3.5
PB5: length 39.2
  Top Layer w0.305: U1.41 51.83,41.03 v1(52.2,41.4)
  Bottom Layer w0.305: U9.8 64.01,17.53 63.75,17.27 53.09,17.27 52.58,17.78 52.58,21.21 52.2,21.59 v1(52.2,41.4)
PB8: length 46.1
  Top Layer w0.305: U5.6 30.99,57.91 31.11,58.04 34.29,58.04 34.8,57.53 v1(42.29,57.53) ; U1.45 53.83,37.7 53.34,37.21 42.93,37.21 v1(42.55,37.59)
  Bottom Layer w0.305: v1(42.29,57.53) 42.55,57.28 v1(42.55,37.59)
PB9: length 52.3
  Top Layer w0.305: U5.4 28.45,58.42 28.75,58.73 42.75,58.73 43.18,58.29 v1(43.18,57.91) ; U1.46 54.33,37.18 53.72,36.58 43.69,36.58 v1(43.43,36.32)
  Bottom Layer w0.305: v1(43.18,57.91) 43.43,57.66 v1(43.43,36.32)
PB10: length 27.9
  Top Layer w0.305: U5.5 30.99,55.25 31.24,55.5 48.09,55.5 48.64,54.95 48.64,51.05 49.4,50.29 50.8,50.29 51.33,49.76 U1.21
PB11: length 22.1
  Top Layer w0.305: U1.22 50.83,49.25 50.29,49.78 49.15,49.78 47.75,51.18 47.75,53.59 47.12,54.23 U5.7
PB12: length 32.5
  Top Layer w0.305: U1.25 46.79,46.44 46.48,46.74 46.48,49.73 45.54,50.67 26.42,50.67 26.04,50.29 26.04,46.61 25.64,46.22 U7.22
PB13: length 32.4
  Top Layer w0.305: U1.26 46.15,45.94 45.85,46.24 45.85,49.23 45.03,50.04 27.05,50.04 26.8,49.78 26.8,46.1 26.29,45.59 23.4,45.59 U7.21
PB14: length 29.2
  Top Layer w0.305: U1.27 45.44,45.44 45.21,45.21 45.21,44.2 44.96,43.94 38.86,43.94 38.35,44.45 38.35,45.21 37.97,45.59 29.72,45.59 29.59,45.47 29.59,43.99 29.29,43.69 25.4,43.69 24.68,42.97 U7.17
PB15: length 28.1
  Top Layer w0.305: U7.16 24.92,42.32 25.78,43.18 29.72,43.18 30.1,43.56 30.1,44.45 30.35,44.7 v1(31.75,44.7) ; U1.28 45.95,44.94 45.72,44.7 45.72,43.82 45.34,43.43 38.48,43.43 37.21,44.7 v1(35.94,44.7)
  Bottom Layer w0.305: v1(31.75,44.7) v1(35.94,44.7)
$1N2904: length 3.5
  Top Layer w0.762: C15.2 26.04,25.78 25.4,25.15 U4.1
$1N3619: length 1.5
  Top Layer w0.305: R21.2 64.68,44.04 LED2.2
$1N3622: length 1.7
  Top Layer w0.305: R20.2 64.32,12.33 64.38,12.26

## Copper pours and planes (outline as drawn; the poured copper is in the pictures)
+5V on Top Layer: 19.04,32.51 23.75,32.51 23.75,28.86 19.04,28.86
+5V on Top Layer: 19.05,38.48 23.37,38.48 23.37,29.08 19.05,29.08
+5V on Top Layer: 22.58,45.13 24.38,45.13 24.38,44.1 22.58,44.1
+5V on Top Layer: 19.04,32.51 22.35,32.51 22.35,20.96 19.04,20.96
GND on Top Layer: -20.19,64.14 107.82,64.14 107.82,-7.11 -20.19,-7.11
GND on Bottom Layer: -4.7,98.81 77.47,98.81 77.47,-25.27 -4.7,-25.27
VBAT on Top Layer: 19.24,48.77 20.7,48.77 20.7,39.12 19.24,39.12
VBAT on Top Layer: 30.35,22.99 41.4,22.99 41.4,21.99 30.35,21.99
VBAT on Top Layer: 27.69,42.55 30.23,42.55 30.23,35.94 27.69,35.94
VBAT on Top Layer: 36.03,23.13 38.86,23.13 38.86,13.46 36.03,13.46
VBAT on Top Layer: 22.61,41.28 28.83,41.28 28.83,39.12 22.61,39.12
VBAT on Top Layer: 38.89,38.74 41.48,38.74 41.48,21.73 38.89,21.73
VBAT on Top Layer: 27.69,42.55 30.23,42.55 30.23,35.94 27.69,35.94
VBAT on Top Layer: 27.69,42.55 30.23,42.55 30.23,35.94 27.69,35.94
VBAT on Top Layer: 27.69,42.55 30.23,42.55 30.23,35.94 27.69,35.94
VBAT on Top Layer: 19.24,48.77 24.13,48.77 24.13,47.37 19.24,47.37
VBAT on Top Layer: 19.37,41.29 24.27,41.29 24.27,39.12 19.37,39.12
VBAT on Top Layer: 35.98,15.75 42.67,15.75 42.67,13.51 35.98,13.51
VBAT on Top Layer: 27.69,42.55 30.23,42.55 30.23,35.94 27.69,35.94
VBAT on Top Layer: 27.69,42.55 30.23,42.55 30.23,35.94 27.69,35.94
VBAT on Top Layer: 22.61,48.77 24.13,48.77 24.13,47.37 22.61,47.37
VBAT on Top Layer: 27.69,38.48 41.28,38.48 41.28,35.94 27.69,35.94
VBAT on Top Layer: 39.88,15.75 42.67,15.75 42.67,5.59 39.88,5.59
VBAT on Top Layer: 27.69,42.55 30.23,42.55 30.23,35.94 27.69,35.94
VBAT on Top Layer: 27.69,42.55 30.23,42.55 30.23,35.94 27.69,35.94
AO1 on Top Layer: 10.18,50.17 17,50.17 17,47.37 10.18,47.37
AO1 on Top Layer: 14.35,48.93 17.01,48.93 17.01,46.69 14.35,46.69
AO2 on Top Layer: 15.47,45.09 18.65,45.09 18.65,44.07 15.47,44.07
AO2 on Top Layer: 7.11,52.56 9.4,52.56 9.4,34.69 7.11,34.69
AO2 on Top Layer: 7.14,52.58 18.9,52.58 18.9,51.05 7.14,51.05
AO2 on Top Layer: 17.38,52.57 18.91,52.57 18.91,44.11 17.38,44.11
AO2 on Top Layer: 7.14,36.58 11.79,36.58 11.79,34.67 7.14,34.67
BO1 on Top Layer: 14.41,41.15 16.95,41.15 16.95,39.37 14.41,39.37
BO1 on Bottom Layer: 14.42,41.16 16.96,41.16 16.96,39.38 14.42,39.38
BO1 on Bottom Layer: 10.16,13.84 16.89,13.84 16.89,12.06 10.16,12.06
BO1 on Bottom Layer: 15.18,41.15 16.96,41.15 16.96,12.06 15.18,12.06
BO2 on Top Layer: 12.26,43.82 16.95,43.82 16.95,42.67 12.26,42.67
BO2 on Bottom Layer: 12.19,43.82 13.97,43.82 13.97,24.64 12.19,24.64
BO2 on Bottom Layer: 10.03,26.41 13.97,26.41 13.97,24.64 10.03,24.64
$1N2900 on Top Layer: 23.26,23.69 24.15,23.69 24.15,21.11 23.26,21.11
$1N2902 on Top Layer: 21.16,20.45 25.91,20.45 25.91,19.48 21.16,19.48
$1N3295 on Top Layer: 28.24,27.94 37.21,27.94 37.21,25.38 28.24,25.38
$1N3295 on Top Layer: 30.35,27.56 31.62,27.56 31.62,23.5 30.35,23.5
$1N3295 on Top Layer: 28.24,32.64 29.97,32.64 29.97,25.54 28.24,25.54
$1N21548 on Top Layer: 34.04,8.89 39.17,8.89 39.17,5.72 34.04,5.72
$1N21548 on Top Layer: 15.37,8.51 30.86,8.51 30.86,4.95 15.37,4.95
$1N21548 on Top Layer: 27.94,12.57 30.86,12.57 30.86,4.95 27.94,4.95
$1N21548 on Top Layer: 15.37,18.16 18.29,18.16 18.29,4.95 15.37,4.95
$1N21548 on Top Layer: 15.37,18.29 23.62,18.29 23.62,15.66 15.37,15.66
$1N21548 on Top Layer: 27.94,12.57 36.28,12.57 36.28,10.03 27.94,10.03
$1N21548 on Top Layer: 33.66,12.57 36.28,12.57 36.28,5.72 33.66,5.72

## Text on the board
Top Silkscreen Layer: GND | CLK | DIO | 3V3 | A2 | A3
